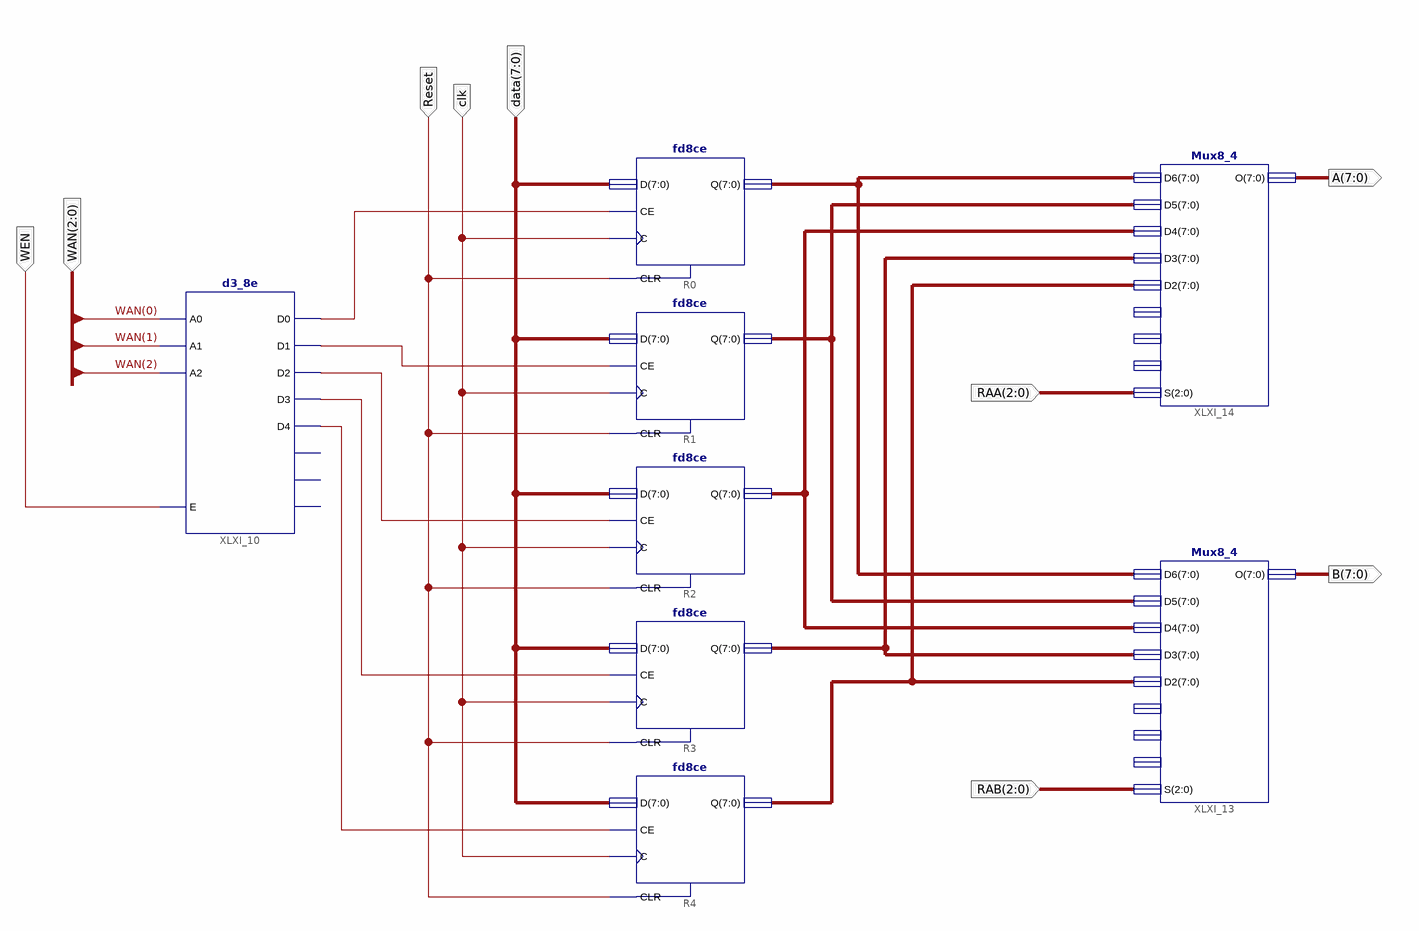
[diagram p0: schematic sheet 1]
// Xilinx ISE schematic unite_lecture_ecriture_des_registres.sch (spartan3e) as structural Verilog: 8 symbols, 9 ports
module unite_lecture_ecriture_des_registres (
  input  [7:0] data,
  input  clk,
  input  [2:0] WAN,
  input  WEN,
  input  Reset,
  input  [2:0] RAB,
  input  [2:0] RAA,
  output [7:0] B,
  output [7:0] A
);

  wire XLXN_5, XLXN_16, XLXN_17, XLXN_19, XLXN_20;
  wire [7:0] XLXN_36, XLXN_37, XLXN_39, XLXN_40, XLXN_44;

  fd8ce R0 (.C(clk), .CE(XLXN_5), .CLR(Reset), .D(data), .Q(XLXN_36));
  fd8ce R1 (.C(clk), .CE(XLXN_16), .CLR(Reset), .D(data), .Q(XLXN_40));
  fd8ce R2 (.C(clk), .CE(XLXN_17), .CLR(Reset), .D(data), .Q(XLXN_39));
  fd8ce R3 (.C(clk), .CE(XLXN_19), .CLR(Reset), .D(data), .Q(XLXN_44));
  fd8ce R4 (.C(clk), .CE(XLXN_20), .CLR(Reset), .D(data), .Q(XLXN_37));
  d3_8e XLXI_10 (
    .A0(WAN[0]), .A1(WAN[1]), .A2(WAN[2]), .E(WEN), .D0(XLXN_5), .D1(XLXN_16), .D2(XLXN_17), .D3(XLXN_19),
    .D4(XLXN_20));  // open: D5, D6, D7
  Mux8_4 XLXI_13 (
    .S(RAB), .D2(XLXN_37), .D3(XLXN_44), .D4(XLXN_39), .D5(XLXN_40), .D6(XLXN_36), .O(B));  // open: D0, D1, D7
  Mux8_4 XLXI_14 (
    .S(RAA), .D2(XLXN_37), .D3(XLXN_44), .D4(XLXN_39), .D5(XLXN_40), .D6(XLXN_36), .O(A));  // open: D0, D1, D7
endmodule
